# EAGLE design Filter (EAGLE 7.5.0)
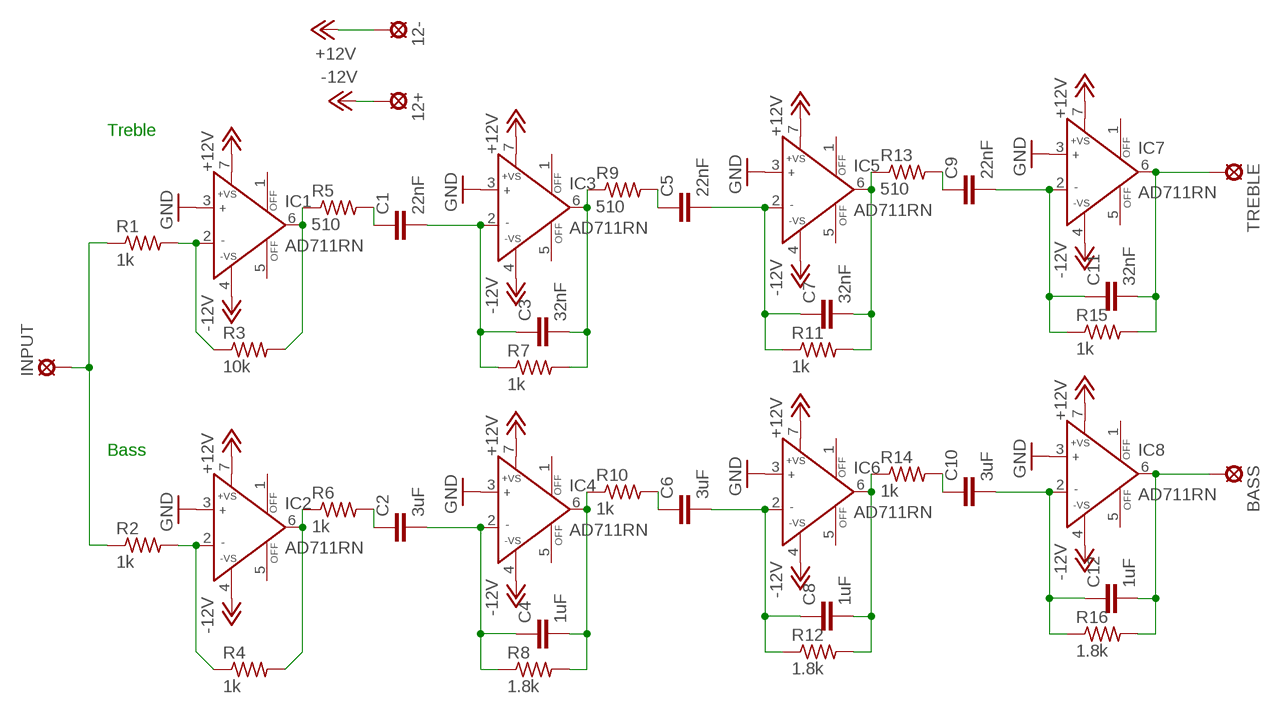
[diagram p0: schematic, sheet 1]

## Parts
12+  MCS10B  [MCS10B]
12-  MCS10B  [MCS10B]
BASS  MCS10B  [MCS10B]
C1  22nF  C  [C0805]
C2  3uF  C  [C0805]
C3  32nF  C  [C0805]
C4  1uF  C  [C0805]
C5  22nF  C  [C0805]
C6  3uF  C  [C0805]
C7  32nF  C  [C0805]
C8  1uF  C  [C0805]
C9  22nF  C  [C0805]
C10  3uF  C  [C0805]
C11  32nF  C  [C0805]
C12  1uF  C  [C0805]
IC1  AD711RN  [SO8]
IC2  AD711RN  [SO8]
IC3  AD711RN  [SO8]
IC4  AD711RN  [SO8]
IC5  AD711RN  [SO8]
IC6  AD711RN  [SO8]
IC7  AD711RN  [SO8]
IC8  AD711RN  [SO8]
INPUT  MCS10B  [MCS10B]
R1  1k  R-US_R0603  [R0603]
R2  1k  R-US_R0603  [R0603]
R3  10k  R-US_R0805  [R0805]
R4  1k  R-US_R0603  [R0603]
R5  510  R-US_R0805  [R0805]
R6  1k  R-US_R0603  [R0603]
R7  1k  R-US_R0603  [R0603]
R8  1.8k  R-US_R0805  [R0805]
R9  510  R-US_R0805  [R0805]
R10  1k  R-US_R0603  [R0603]
R11  1k  R-US_R0603  [R0603]
R12  1.8k  R-US_R0805  [R0805]
R13  510  R-US_R0805  [R0805]
R14  1k  R-US_R0603  [R0603]
R15  1k  R-US_R0603  [R0603]
R16  1.8k  R-US_R0805  [R0805]
TREBLE  MCS10B  [MCS10B]

## Nets
+12V: 12-.MP IC1.7(+VS) IC2.7(+VS) IC3.7(+VS) IC4.7(+VS) IC5.7(+VS) IC6.7(+VS) IC7.7(+VS) IC8.7(+VS)
-12V: 12+.MP IC1.4(-VS) IC2.4(-VS) IC3.4(-VS) IC4.4(-VS) IC5.4(-VS) IC6.4(-VS) IC7.4(-VS) IC8.4(-VS)
GND: IC1.3(IN+) IC2.3(IN+) IC3.3(IN+) IC4.3(IN+) IC5.3(IN+) IC6.3(IN+) IC7.3(IN+) IC8.3(IN+)
N$1: IC1.2(IN-) R1.2 R3.1
N$2: IC1.6(OUT) R3.2 R5.1
N$3: C1.1 R5.2
N$4: C1.2 C3.1 IC3.2(IN-) R7.1
N$5: C3.2 IC3.6(OUT) R7.2 R9.1
N$6: C5.2 C7.1 IC5.2(IN-) R11.1
N$7: C5.1 R9.2
N$8: C7.2 IC5.6(OUT) R11.2 R13.1
N$9: C9.1 R13.2
N$10: C9.2 C11.1 IC7.2(IN-) R15.1
N$11: C11.2 IC7.6(OUT) R15.2 TREBLE.MP
N$20: IC2.2(IN-) R2.2 R4.1
N$21: IC2.6(OUT) R4.2 R6.1
N$22: C2.1 R6.2
N$23: C2.2 C4.1 IC4.2(IN-) R8.1
N$24: C4.2 IC4.6(OUT) R8.2 R10.1
N$25: C6.1 R10.2
N$26: C6.2 C8.1 IC6.2(IN-) R12.1
N$28: C8.2 IC6.6(OUT) R12.2 R14.1
N$30: C10.1 R14.2
N$31: C10.2 C12.1 IC8.2(IN-) R16.1
N$32: BASS.MP C12.2 IC8.6(OUT) R16.2
N$40: INPUT.MP R1.1 R2.1
Unconnected: IC1.1(OFF) IC1.5(OFF) IC2.1(OFF) IC2.5(OFF) IC3.1(OFF) IC3.5(OFF) IC4.1(OFF) IC4.5(OFF) IC5.1(OFF) IC5.5(OFF) IC6.1(OFF) IC6.5(OFF) IC7.1(OFF) IC7.5(OFF) IC8.1(OFF) IC8.5(OFF)

## Notes on the sheet
- Treble
- Bass

## Library data of the parts
12+ 12- BASS INPUT TREBLE = solpad:MCS10B: SOLDER PAD MC S1, distributor Buerklin, 15F505
C1 C5 C9 = eagle-ltspice:C: CAPACITOR, European symbol; MPN: UA741CPE4; OC_NEWARK: 63K6631; SPICEMODEL: NONE; SPICEPREFIX: C
C2 C6 C10 = eagle-ltspice:C: CAPACITOR, European symbol; MPN: TMCP1C335KTRF; OC_NEWARK: 56Y0129; SPICEMODEL: NONE; SPICEPREFIX: C
C3 C7 C11 = eagle-ltspice:C: CAPACITOR, European symbol; OC_NEWARK: unknown; SPICEMODEL: NONE; SPICEPREFIX: C
C4 C8 C12 = eagle-ltspice:C: CAPACITOR, European symbol; MPN: 6TPU33MSK; OC_NEWARK: 98W1040; SPICEMODEL: NONE; SPICEPREFIX: C
IC1-IC8 = analog-devices:AD711: Precision, Low Cost, High Speed, BiFET Op Amp Source: http://www.analog.com/static/imported-files/data_sheets/AD711.pdf; MF: TEXAS INSTRUMENTS; MPN: UA741CP; OC_FARNELL: 9426396; OC_NEWARK: 60K7043
R1 R2 R4 R6 R7 R10 R11 R14 R15 = resistor:R-US_: RESISTOR, American symbol; MPN: ERJ-3EKF1001V; OC_NEWARK: 64R5308
R3 = resistor:R-US_: RESISTOR, American symbol; MPN: MC0603B104K500CT; OC_NEWARK: 06R4927
R5 R9 R13 = resistor:R-US_: RESISTOR, American symbol; MPN: ERA-6AEB511V; OC_NEWARK: 01X1398
R8 R12 R16 = resistor:R-US_: RESISTOR, American symbol; MPN: ERA-6AEB182V; OC_NEWARK: 08N2154

## Board
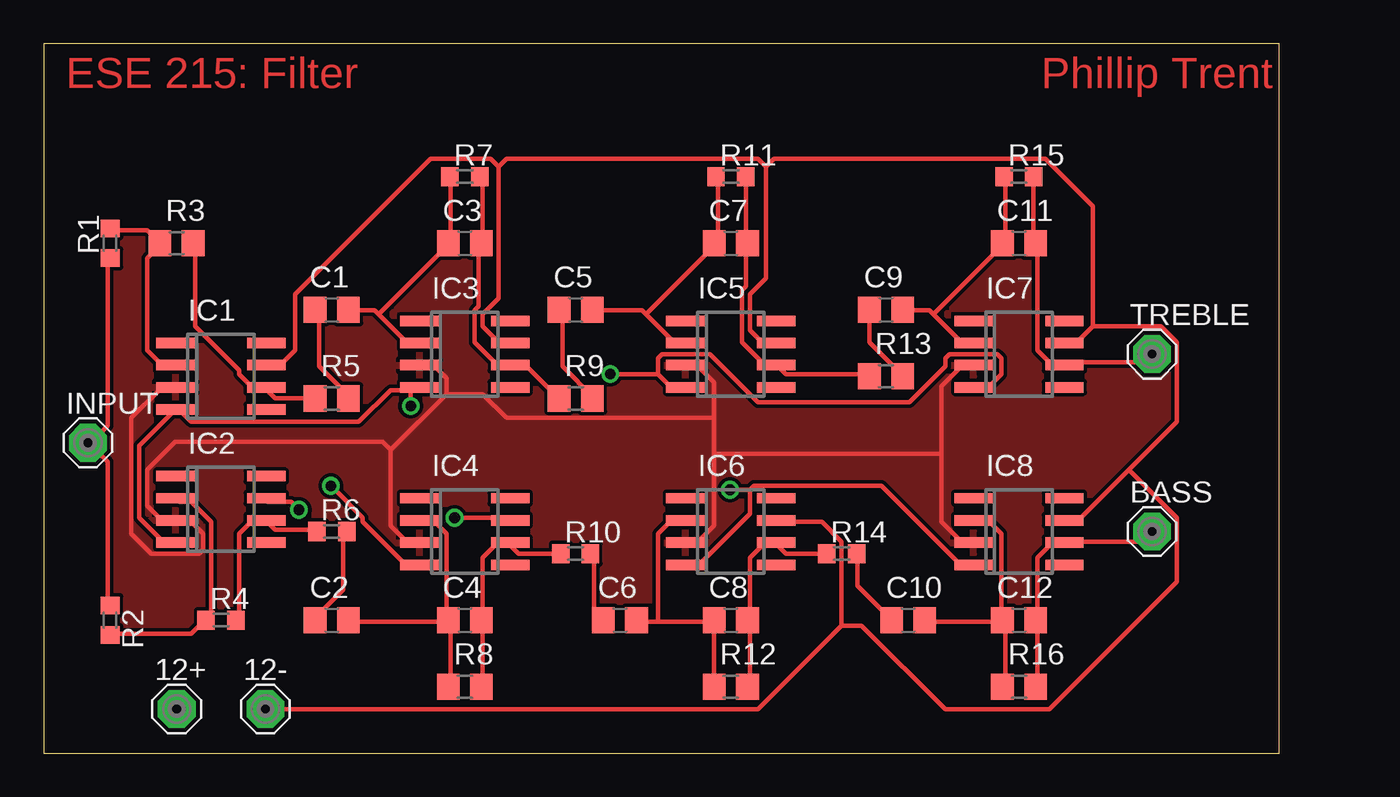
[diagram p1: board, top side]
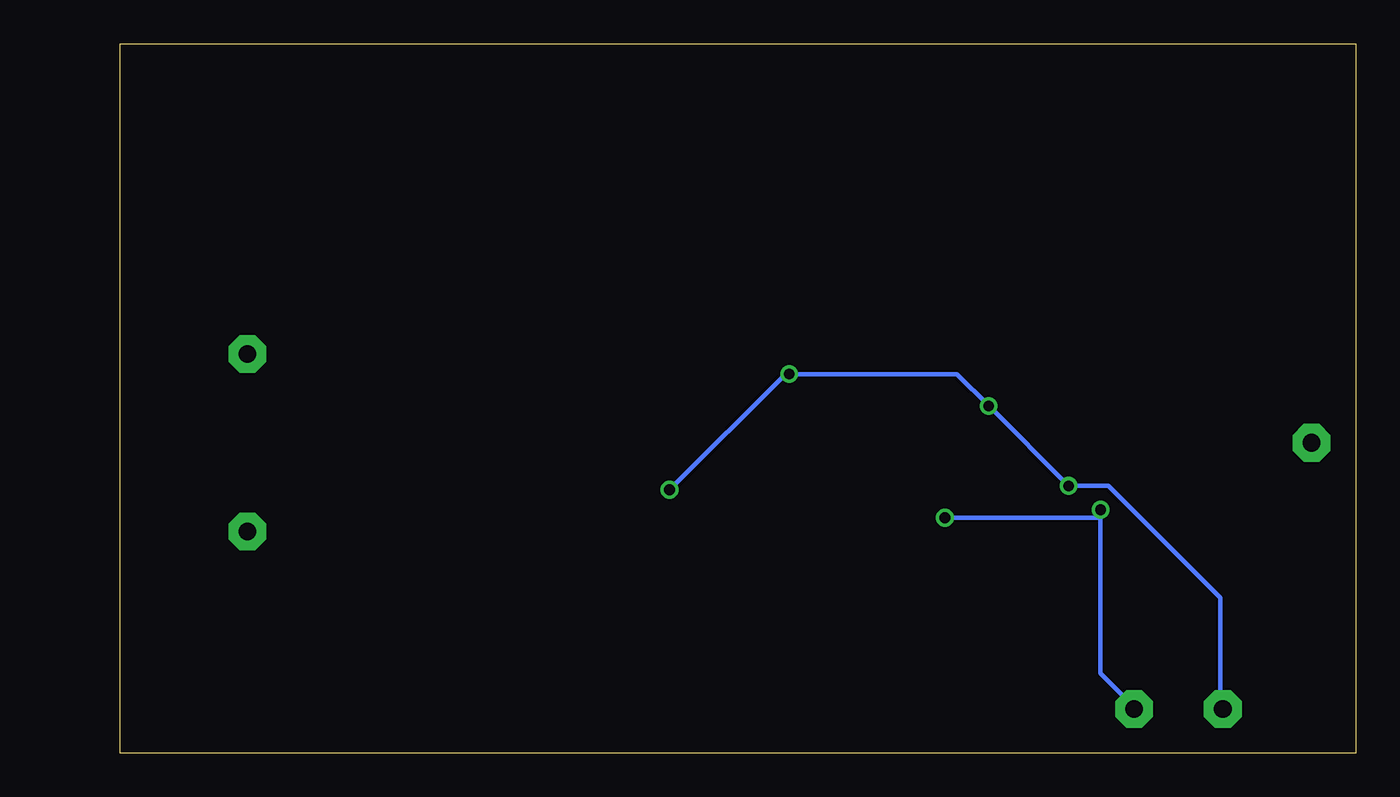
[diagram p2: board, bottom side, seen from below]

Size 70.79 x 40.64 mm. Coordinates in mm from the lower left corner, seen from the top.
Outline: 0,0 70.79,0 70.79,40.63 0,40.64 0,0
Copper layers (1*16): Top 0.035mm / dielectric 1.5mm / Bottom 0.035mm
Design rules "default": minimum track width 10mil, minimum drill 24mil, track to track 8mil, track to pad 8mil, pad to pad 8mil, via to via 8mil, smd to smd 8mil, copper to edge 40mil, drill to drill 8mil, minimum pad ring 10mil, minimum via ring 8mil, stop-mask expansion 4mil, vias tented up to drill 0mil, thermal gap 10mil

### Footprints (pad centres in the part's own frame; a part is rotated, then mirrored left to right if it is on the bottom)
MCS10B = drill 1.016 pad 2.159 octagon: MP 0,0
C0805 = smd 1.3 x 1.5: 1 -0.95,0; 2 0.95,0
SO8 = smd 0.6 x 2.2: 1 -1.905,-2.6; 2 -0.635,-2.6; 3 0.635,-2.6; 4 1.905,-2.6; 5 1.905,2.6; 6 0.635,2.6; 7 -0.635,2.6; 8 -1.905,2.6
R0603 = smd 1 x 1.1: 1 -0.85,0; 2 0.85,0
R0805 = smd 1.3 x 1.5: 1 -0.95,0; 2 0.95,0

### Placement (x,y rotation side)
12+  7.62,2.54 0 top
12-  12.7,2.54 0 top
BASS  63.5,12.7 0 top
C1  16.51,25.4 0 top
C2  16.51,7.62 0 top
C3  24.13,29.21 0 top
C4  24.13,7.62 0 top
C5  30.48,25.4 0 top
C6  33.02,7.62 0 top
C7  39.37,29.21 0 top
C8  39.37,7.62 0 top
C9  48.26,25.4 0 top
C10  49.53,7.62 0 top
C11  55.88,29.21 0 top
C12  55.88,7.62 0 top
IC1  10.16,21.59 270 top
IC2  10.16,13.97 270 top
IC3  24.13,22.86 270 top
IC4  24.13,12.7 270 top
IC5  39.37,22.86 270 top
IC6  39.37,12.7 270 top
IC7  55.88,22.86 270 top
IC8  55.88,12.7 270 top
INPUT  2.54,17.78 0 top
R1  3.81,29.21 90 top
R2  3.81,7.62 270 top
R3  7.62,29.21 0 top
R4  10.16,7.62 0 top
R5  16.51,20.32 0 top
R6  16.51,12.7 0 top
R7  24.13,33.02 0 top
R8  24.13,3.81 0 top
R9  30.48,20.32 0 top
R10  30.48,11.43 0 top
R11  39.37,33.02 0 top
R12  39.37,3.81 0 top
R13  48.26,21.59 0 top
R14  45.72,11.43 0 top
R15  55.88,33.02 0 top
R16  55.88,3.81 0 top
TREBLE  63.5,22.86 0 top

### Tracks (layer width: path | path; a pad name or v marks a point on that pad's centre or on a via)
+12V  (via drill 0.61)
  Top 0.254: v14.63,13.95 14.17,14.4 12.8,14.4 IC2.7 | v23.55,13.49 26.52,13.49 IC4.7 | 45.72,7.32 45.72,12.12 44.58,13.26 42.06,13.26 IC6.7 | 45.72,7.32 40.92,2.52 12.8,2.52 12-.MP | 62.18,16.23 64.92,18.97 64.92,23.55 64.01,24.46 60.12,24.46 | 62.18,16.23 59.44,13.49 58.52,13.49 IC8.7 | 60.12,24.46 59.21,23.55 58.52,23.55 IC7.7 | 26.06,33.6 25.6,34.06 22.17,34.06 14.4,26.29 14.4,23.09 13.72,22.4 12.8,22.4 IC1.7 | 26.06,33.6 26.06,26.06 25.15,25.15 25.15,24.46 26.06,23.55 26.52,23.55 IC3.7 | 41.38,33.6 41.38,27.2 40.46,26.29 40.46,24.23 41.15,23.55 41.83,23.55 IC5.7 | 41.38,33.6 40.92,34.06 26.52,34.06 26.06,33.6 | 60.12,24.46 60.12,31.32 57.38,34.06 41.83,34.06 41.38,33.6 | 45.72,7.32 46.86,7.32 51.66,2.52 57.61,2.52 64.92,9.83 64.92,13.49 62.18,16.23
  Bottom 0.254: 14.63,13.49 14.63,4.57 12.8,2.74 12-.MP | 14.63,13.49 v23.55,13.49 | 14.63,13.49 v14.63,13.95
-12V  (via drill 0.61)
  Top 0.254: IC2.4 7.54,12.12 6.86,12.12 5.49,13.49 5.49,17.6 7.54,19.66 IC1.4 7.77,19.66 8.46,18.97 18.06,18.97 19.89,20.8 21.03,20.8 | 21.03,20.8 21.49,20.8 IC3.4 21.03,20.8 | 40.46,15.09 40.46,13.72 37.72,10.97 36.8,10.97 IC6.4 | 40.46,15.09 40.69,15.32 48.01,15.32 52.35,10.97 53.26,10.97 IC8.4 | 35.2,21.72 35.89,21.03 36.58,21.03 IC5.4 | 35.2,21.72 35.2,22.63 35.43,22.86 38.18,22.86 40.92,20.12 49.61,20.12 51.66,22.17 51.66,22.63 51.89,22.86 54.63,22.86 54.86,22.63 54.86,21.72 54.18,21.03 53.49,21.03 IC7.4 | v16.46,15.32 18.29,13.49 18.29,13.26 20.57,10.97 21.49,10.97 IC4.4 | v32.46,21.72 35.2,21.72 | v39.32,15.09 40.46,15.09 | v21.03,19.89 21.03,20.8
  Bottom 0.254: 12+.MP 7.77,2.74 7.77,8.91 14.17,15.32 v16.46,15.32 v21.03,19.89 22.86,21.72 v32.46,21.72 32.69,21.72 v39.32,15.09
GND
  Top 0.254: IC1.3 7.54,20.8 6.63,20.8 5.03,19.2 5.03,12.57 6.17,11.43 8.91,11.43 9.14,11.66 9.14,12.57 8.46,13.26 7.77,13.26 IC2.3 7.54,13.49 6.63,13.49 5.94,14.17 5.94,16.23 7.54,17.83 19.43,17.83 19.89,17.37 | 19.89,17.37 19.89,13.03 20.8,12.12 21.49,12.12 IC4.3 | 23.09,20.57 19.89,17.37 | 23.09,20.57 23.09,21.49 22.4,22.17 21.72,22.17 IC3.3 | 38.41,19.2 38.41,21.26 37.49,22.17 36.8,22.17 IC5.3 | 38.41,19.2 38.41,17.14 | 38.41,17.14 38.41,13.03 37.49,12.12 36.8,12.12 IC6.3 | 51.44,17.14 51.44,21.03 52.58,22.17 53.26,22.17 IC7.3 | 51.44,17.14 51.44,13.26 52.58,12.12 53.26,12.12 IC8.3 | 51.44,17.14 38.41,17.14 | 23.09,20.57 25.15,20.57 26.52,19.2 38.41,19.2
  pour Top: -1.27,43.18 72.39,43.18 72.39,-2.54 -2.54,-2.54 -2.54,43.18
N$1
  Top 0.254: R1.2 3.89,29.95 5.94,29.95 6.63,29.26 R3.1 6.63,29.03 5.94,28.35 5.94,23.09 6.63,22.4 7.54,22.4 IC1.2
N$2
  Top 0.254: R3.2 8.69,29.03 8.69,24.46 11.2,21.95 11.2,21.72 11.89,21.03 12.57,21.03 IC1.6 12.8,20.8 13.26,20.34 15.54,20.34 R5.1
N$3
  Top 0.254: C1.1 15.77,25.38 15.77,22.17 17.6,20.34 R5.2
N$4
  Top 0.254: R7.1 23.32,32.92 23.32,29.26 C3.1 23.09,29.03 19.2,25.15 | 19.2,25.15 20.8,23.55 21.49,23.55 IC3.2 | 19.2,25.15 18.97,25.38 17.6,25.38 C1.2
N$5
  Top 0.254: R7.2 25.15,32.92 25.15,29.26 C3.2 24.92,29.03 24.92,25.6 24.69,25.38 24.69,23.55 25.83,22.4 26.52,22.4 IC3.6 26.75,22.17 27.66,22.17 29.49,20.34 R9.1
N$6
  Top 0.254: R11.1 38.63,32.92 38.63,29.26 C7.1 38.41,29.03 34.52,25.15 | 34.52,25.15 36.12,23.55 36.58,23.55 IC5.2 | 34.52,25.15 34.29,25.38 31.55,25.38 C5.2
N$7
  Top 0.254: C5.1 29.72,25.38 29.72,22.17 31.55,20.34 R9.2
N$8
  Top 0.254: R11.2 40.23,32.92 40.23,29.26 C7.2 40.23,29.03 40.23,26.75 40.01,26.52 40.01,23.55 41.15,22.4 41.83,22.4 IC5.6 42.06,22.17 42.52,21.72 47.09,21.72 R13.1
N$9
  Top 0.254: C9.1 47.32,25.38 47.32,23.55 49.15,21.72 R13.2
N$10
  Top 0.254: R15.1 55.09,32.92 55.09,29.26 C11.1 54.86,29.03 50.98,25.15 | 50.98,25.15 52.58,23.55 53.26,23.55 IC7.2 | 50.98,25.15 50.75,25.38 49.38,25.38 C9.2
N$11
  Top 0.254: R15.2 56.69,32.92 56.69,29.26 C11.2 56.92,29.03 56.92,23.09 57.61,22.4 58.29,22.4 IC7.6 58.52,22.4 62.87,22.4 63.32,22.86 TREBLE.MP
N$20
  Top 0.254: R2.2 3.89,6.86 8.46,6.86 9.14,7.54 R4.1 9.37,7.77 9.6,8 9.6,13.26 8.46,14.4 7.77,14.4 IC2.2
N$21
  Top 0.254: R4.2 11.2,7.77 11.2,12.57 11.89,13.26 12.57,13.26 IC2.6 12.8,13.26 13.26,12.8 15.54,12.8 R6.1
N$22
  Top 0.254: R6.2 17.14,12.57 17.14,9.37 15.54,7.77 C2.1
N$23
  Top 0.254: R8.1 23.32,3.89 23.32,7.54 C4.1 | C2.2 17.6,7.54 23.09,7.54 C4.1 | IC4.2 21.72,13.26 22.4,13.26 23.09,12.57 23.09,7.77 C4.1
N$24
  Top 0.254: R8.2 25.15,3.89 25.15,7.54 C4.2 25.15,7.77 25.15,11.2 25.83,11.89 26.52,11.89 IC4.6 26.75,11.89 27.2,11.43 R10.1
N$25
  Top 0.254: R10.2 31.55,11.43 31.55,8.23 32,7.77 C6.1
N$26
  Top 0.254: 38.41,7.54 35.2,7.54 | 35.2,7.54 34.06,7.54 C6.2 | 38.41,7.54 38.41,3.89 R12.1 | 38.41,7.54 C8.1 | 35.2,7.54 35.2,12.57 35.89,13.26 36.58,13.26 IC6.2
N$28
  Top 0.254: R12.2 40.46,3.89 40.46,7.54 C8.2 40.46,7.77 40.46,11.2 41.15,11.89 41.83,11.89 IC6.6 42.06,11.89 42.52,11.43 R14.1
N$30
  Top 0.254: R14.2 46.63,11.43 46.63,9.6 48.46,7.77 C10.1
N$31
  Top 0.254: C10.2 50.52,7.54 54.86,7.54 C12.1 | R16.1 55.09,3.89 55.09,7.54 C12.1 | IC8.2 53.49,13.26 54.18,13.26 54.86,12.57 54.86,7.77 C12.1
N$32
  Top 0.254: R16.2 56.92,3.89 56.92,7.54 C12.2 56.92,7.77 56.92,11.2 57.61,11.89 58.29,11.89 IC8.6 58.52,12.12 62.87,12.12 63.32,12.57 BASS.MP
N$40
  Top 0.254: R2.1 3.66,8.69 3.66,16.69 2.74,17.6 INPUT.MP 2.74,17.83 3.66,18.75 3.66,28.35 R1.1

### Text on the board
Top: ESE 215: Filter | Phillip Trent